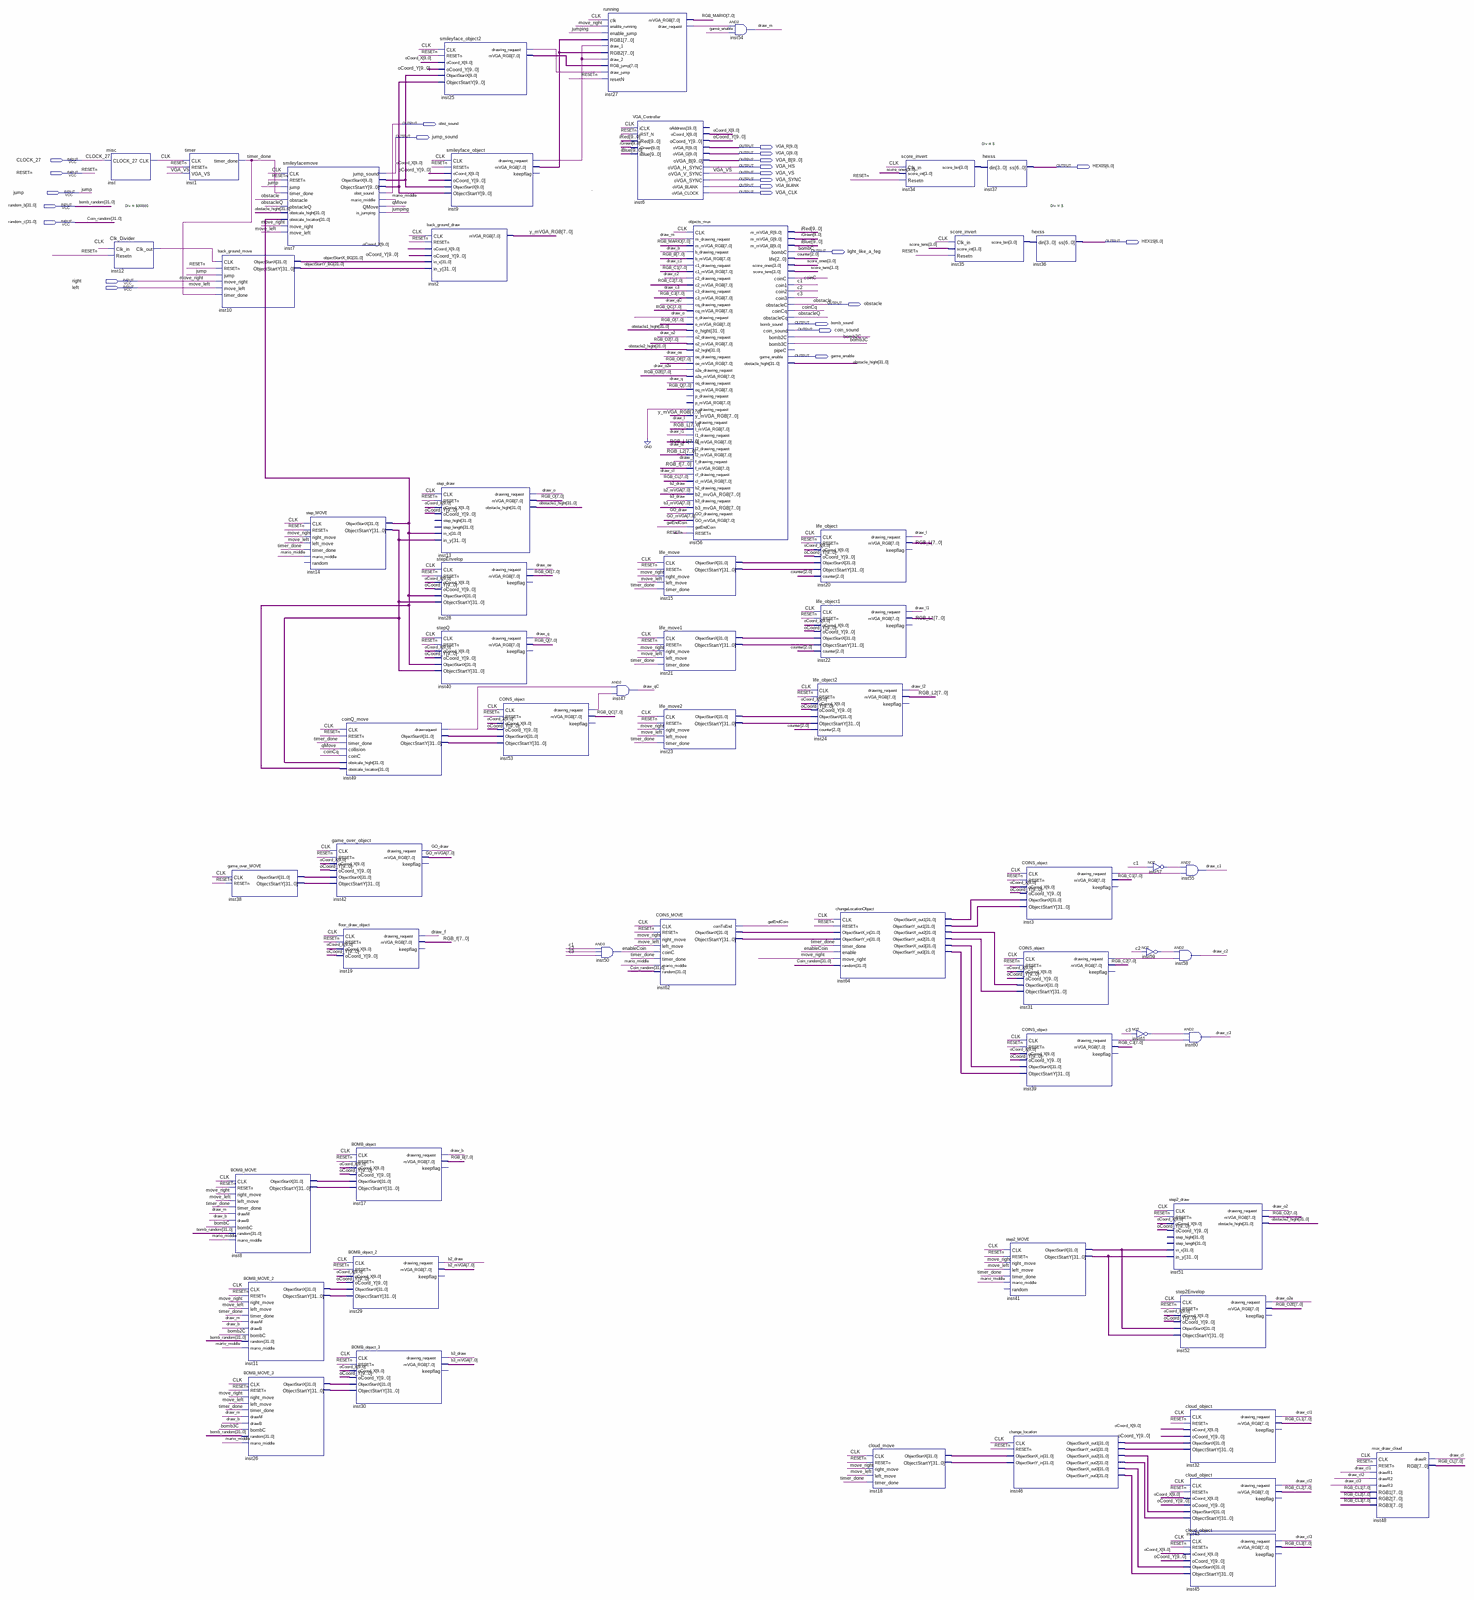
[diagram p0: schematic sheet, whole]
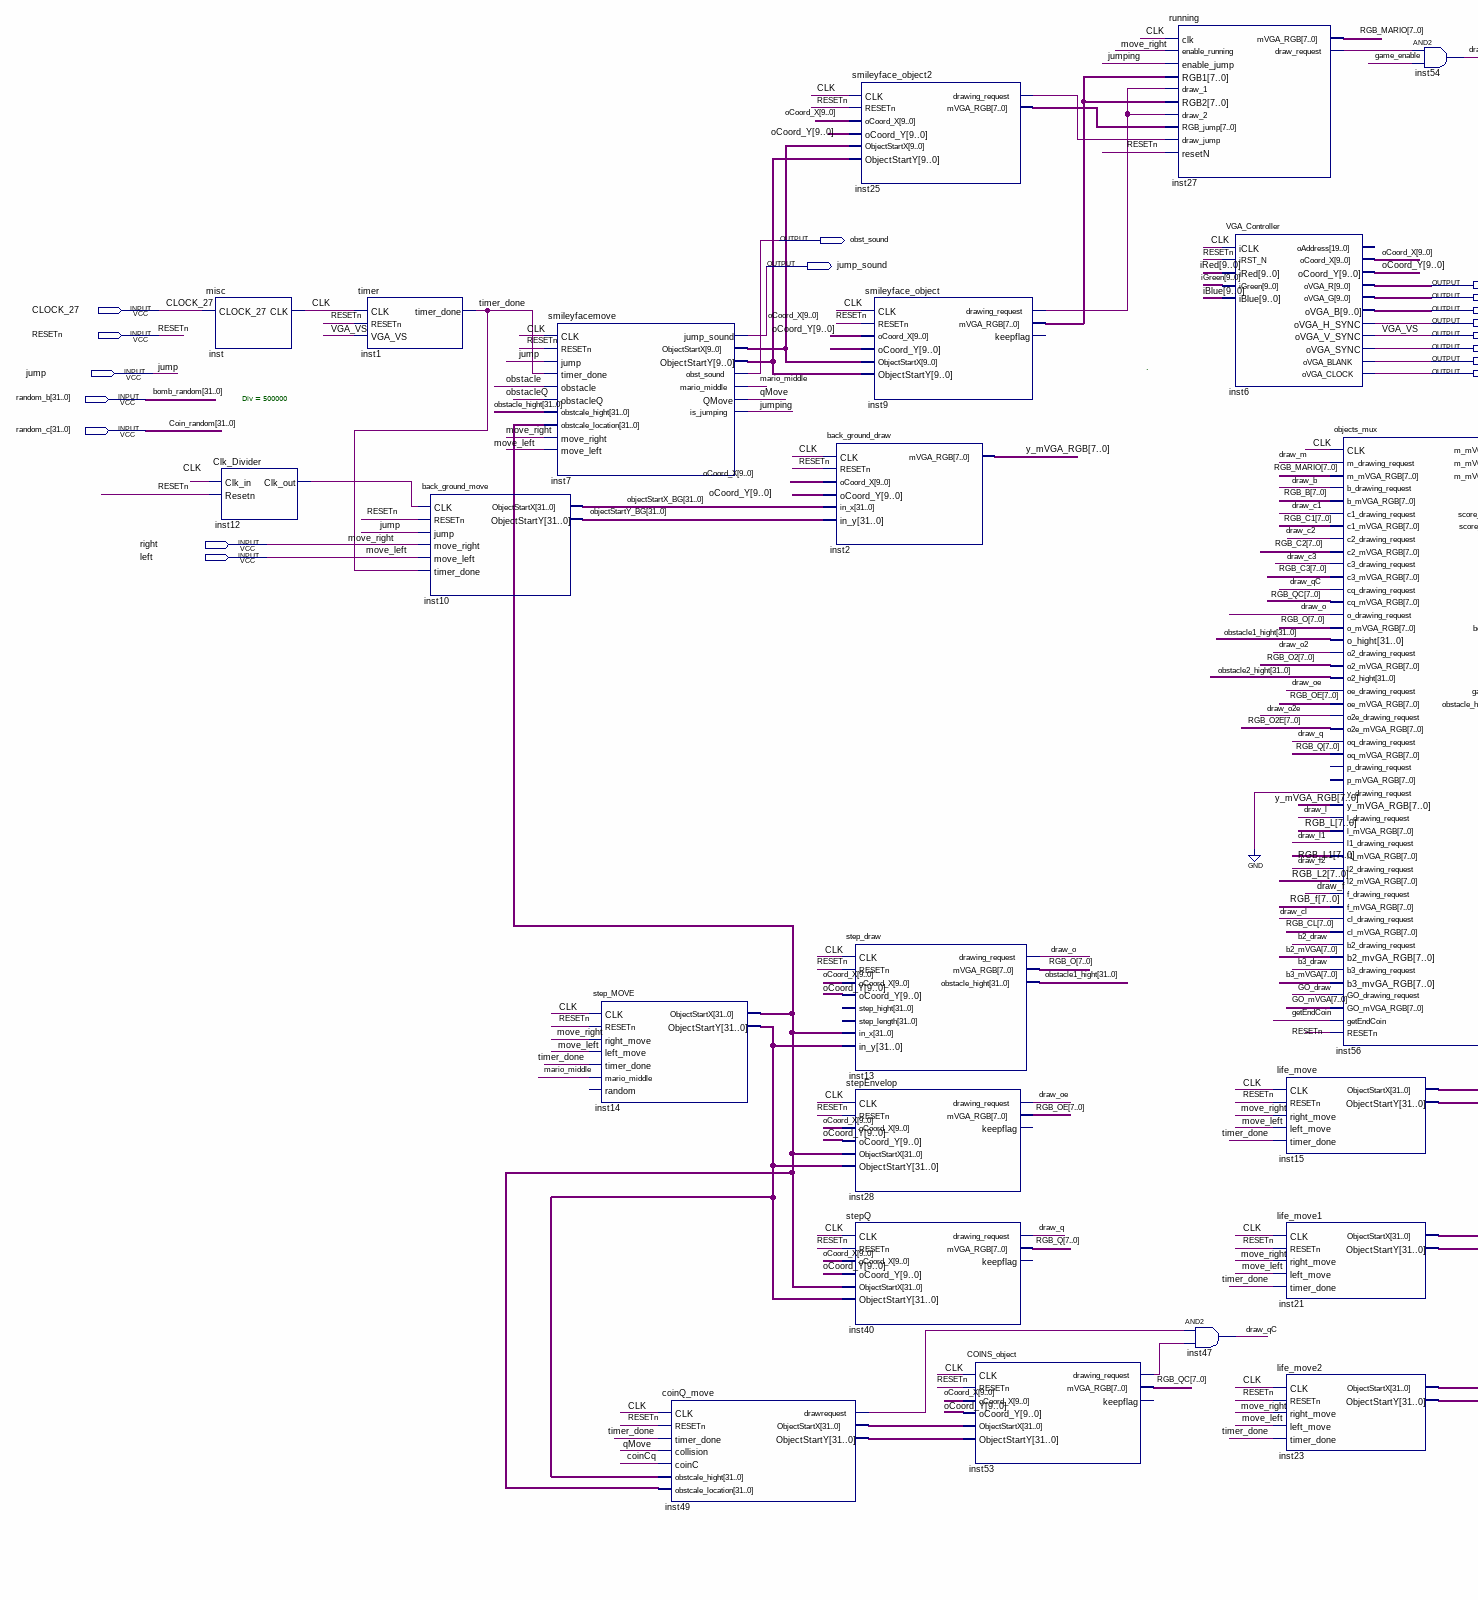
[diagram p1: schematic sheet, upper left part]
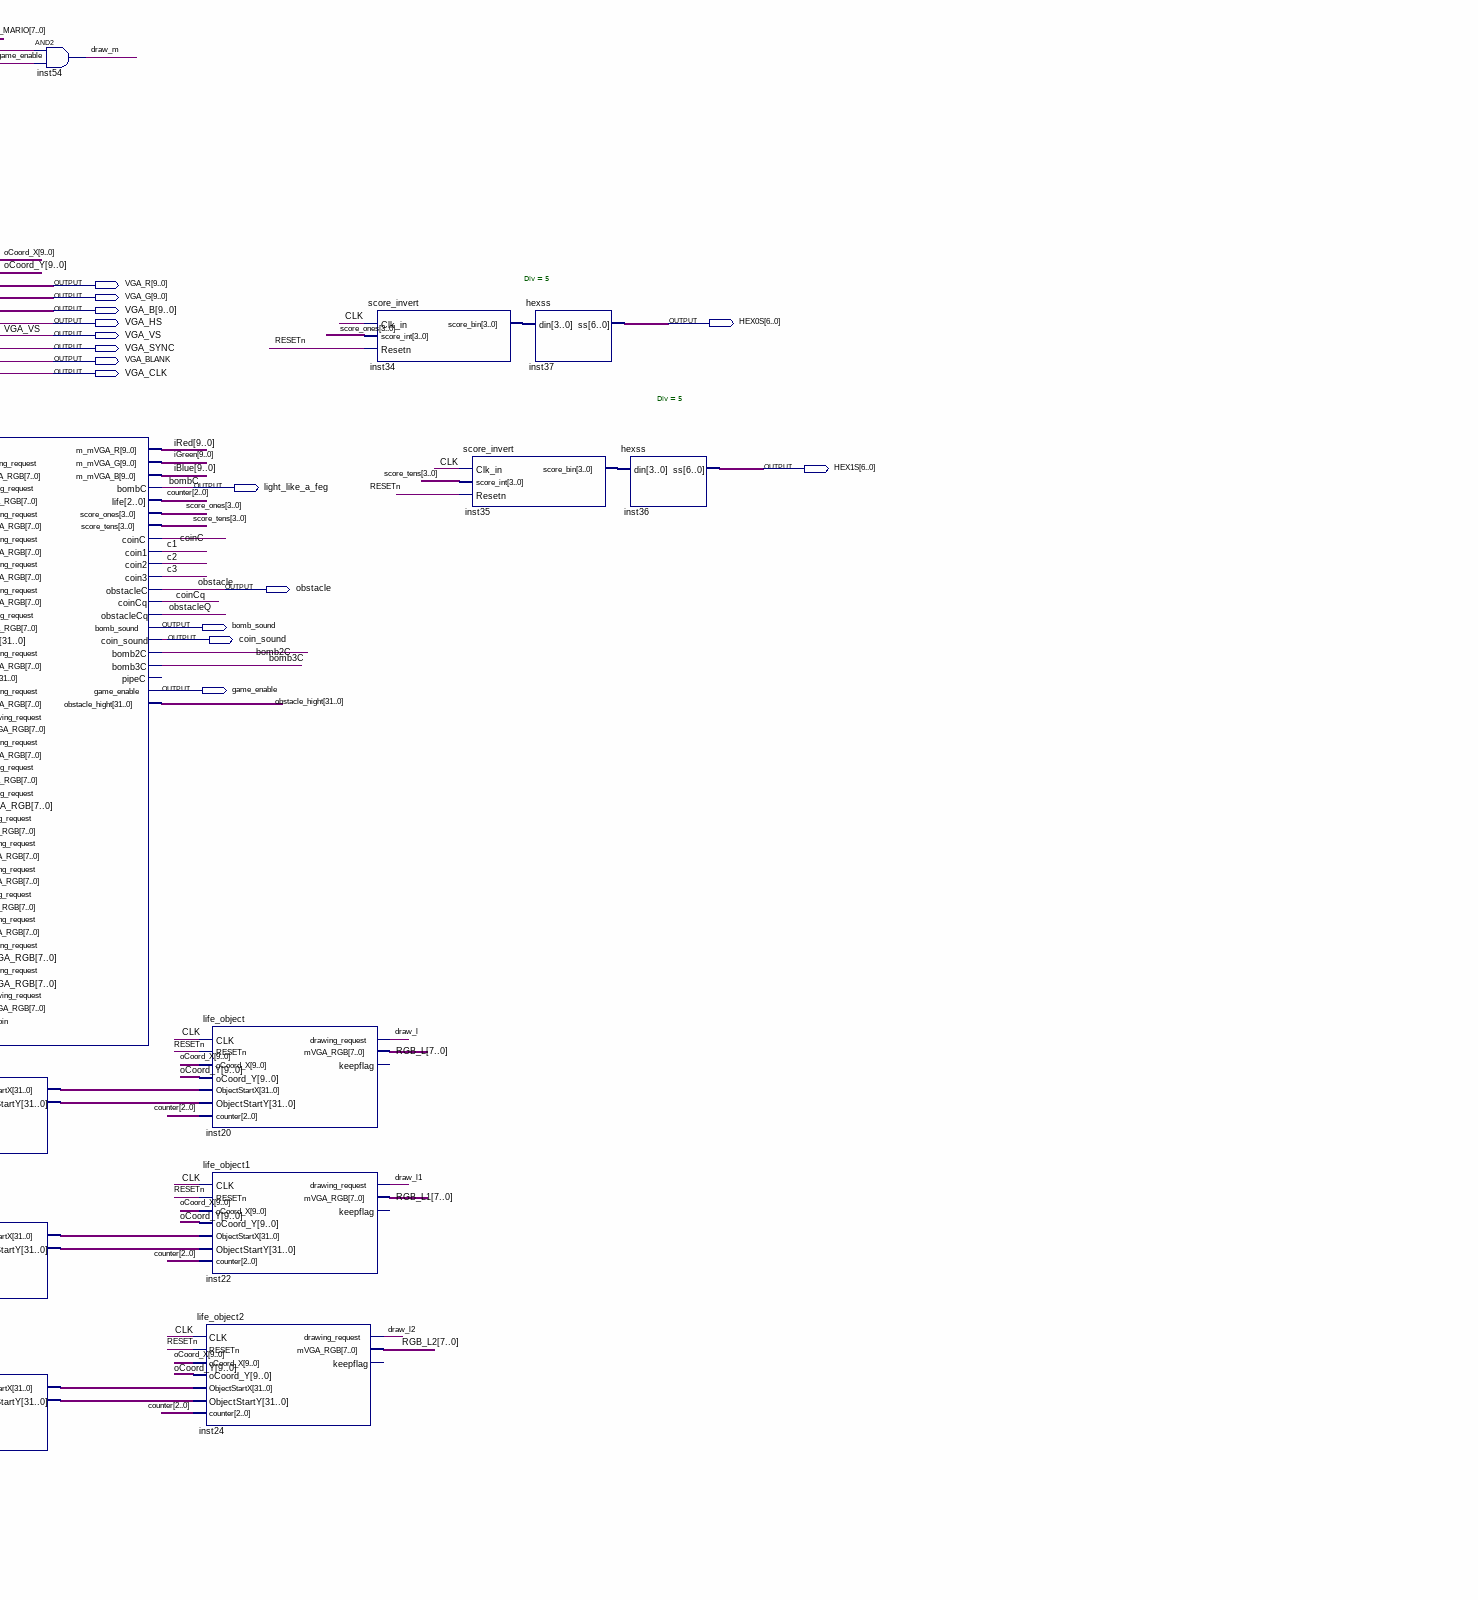
[diagram p2: schematic sheet, upper right part]
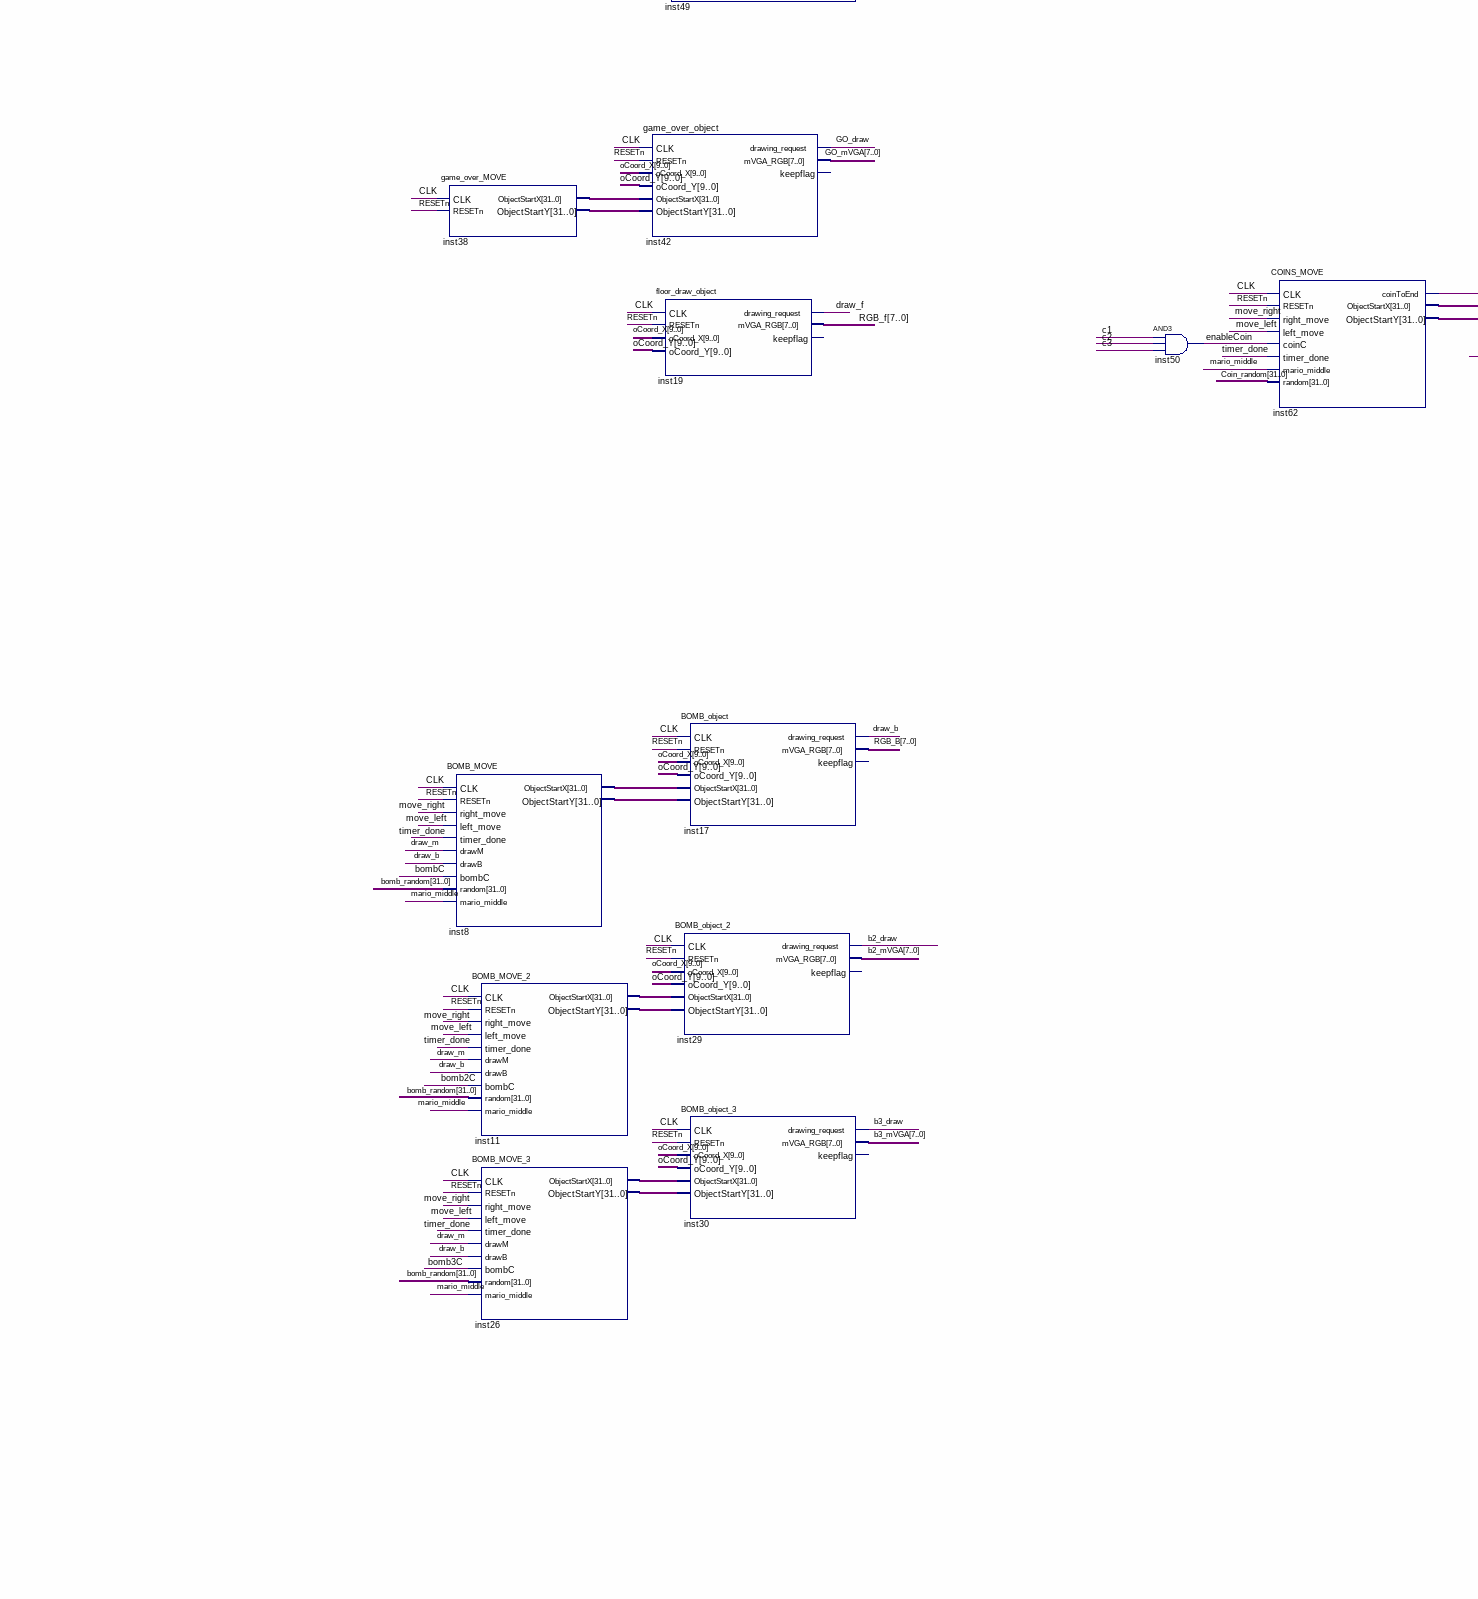
[diagram p3: schematic sheet, lower left part]
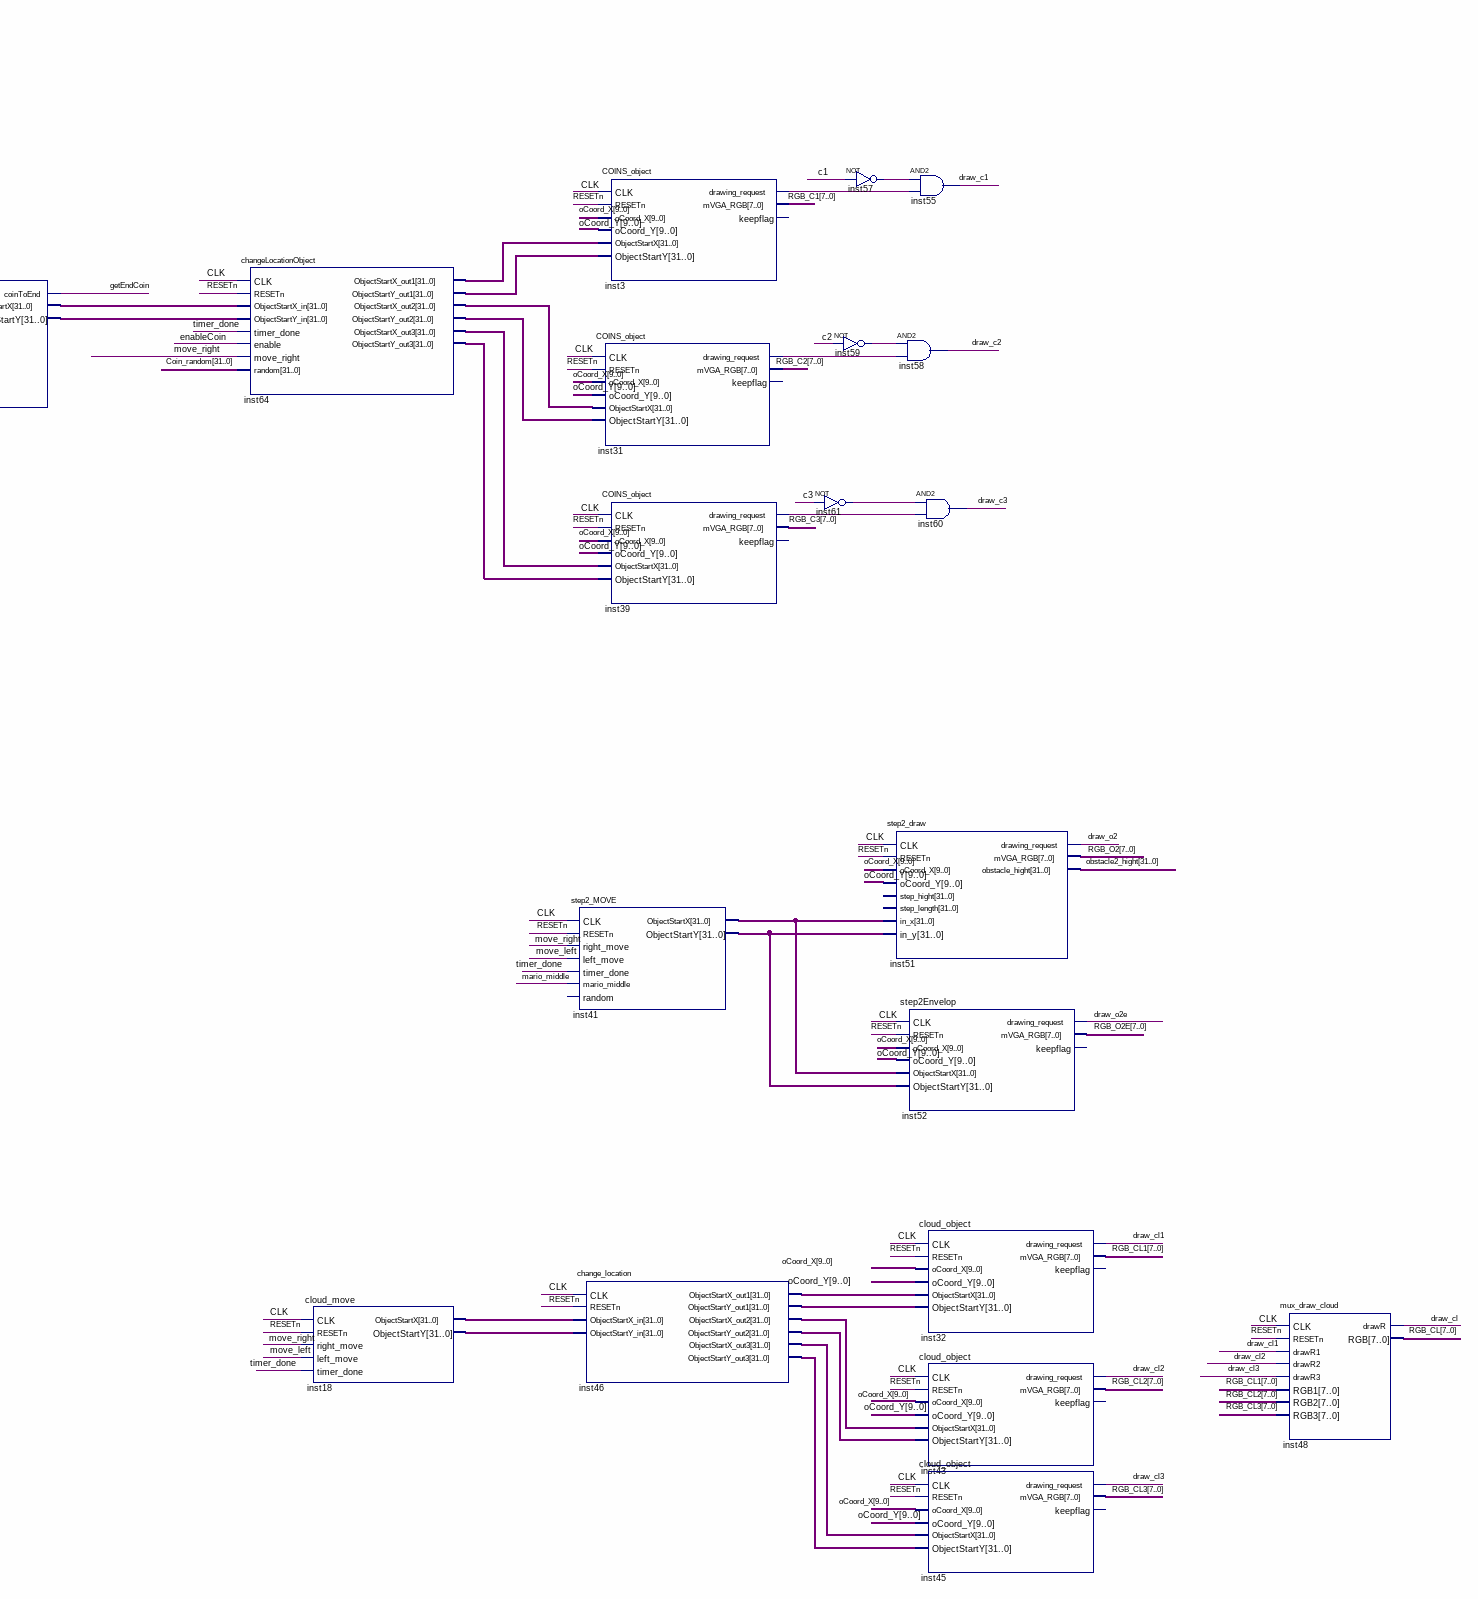
[diagram p4: schematic sheet, lower right part]
// Quartus schematic TOP_SIFTACH.bdf as structural Verilog: 59 symbols, 24 pins
module TOP_SIFTACH (
  input  CLOCK_27,
  input  RESETn,
  input  jump,
  input  [31:0] random_b,
  input  [31:0] random_c,
  input  right,
  input  left,
  output obst_sound,
  output jump_sound,
  output [9:0] VGA_R,
  output [9:0] VGA_G,
  output [9:0] VGA_B,
  output VGA_HS,
  output [6:0] HEX0S,
  output VGA_VS,
  output VGA_SYNC,
  output VGA_BLANK,
  output VGA_CLK,
  output [6:0] HEX1S,
  output light_like_a_feg,
  output obstacle,
  output bomb_sound,
  output coin_sound,
  output game_enable
);

  wire b2_draw, b3_draw, bomb2C, bomb3C, c1, c2, c3, CLK, coinC, coinCq, draw_b, draw_c1, draw_c2, draw_c3,
       draw_cl, draw_cl1, draw_cl2, draw_cl3, draw_f, draw_l, draw_l1, draw_l2, draw_m, draw_o, draw_o2,
       draw_o2e, draw_oe, draw_q, draw_qC, enableCoin, getEndCoin, GO_draw, inst3_drawing_request,
       inst9_drawing_request, inst12_clk_out, inst25_drawing_request, inst27_draw_request,
       inst31_drawing_request, inst39_drawing_request, inst49_drawrequest, inst53_drawing_request,
       inst57_out, inst59_out, inst61_out, jumping, mario_middle, obstacleQ, qMove, timer_done;
  wire [2:0] counter;
  wire [3:0] inst34_score_bin, inst35_score_bin, score_ones, score_tens;
  wire [7:0] b2_mVGA, b3_mVGA, GO_mVGA, inst9_mvga_rgb, inst25_mvga_rgb, RGB_B, RGB_C1, RGB_C2, RGB_C3,
       RGB_CL, RGB_CL1, RGB_CL2, RGB_CL3, RGB_f, RGB_L, RGB_L1, RGB_L2, RGB_MARIO, RGB_O, RGB_O2, RGB_O2E,
       RGB_OE, RGB_Q, RGB_QC, y_mVGA_RGB;
  wire [9:0] iBlue, iGreen, inst7_objectstartx, inst7_objectstarty, iRed, oCoord_X, oCoord_Y;
  wire [31:0] inst8_objectstartx, inst8_objectstarty, inst11_objectstartx, inst11_objectstarty,
       inst14_objectstartx, inst14_objectstarty, inst15_objectstartx, inst15_objectstarty,
       inst18_objectstartx, inst18_objectstarty, inst21_objectstartx, inst21_objectstarty,
       inst23_objectstartx, inst23_objectstarty, inst26_objectstartx, inst26_objectstarty,
       inst38_objectstartx, inst38_objectstarty, inst41_objectstartx, inst41_objectstarty,
       inst46_objectstartx_out1, inst46_objectstartx_out2, inst46_objectstartx_out3,
       inst46_objectstarty_out1, inst46_objectstarty_out2, inst46_objectstarty_out3, inst49_objectstartx,
       inst49_objectstarty, inst62_objectstartx, inst62_objectstarty, inst64_objectstartx_out1,
       inst64_objectstartx_out2, inst64_objectstartx_out3, inst64_objectstarty_out1,
       inst64_objectstarty_out2, inst64_objectstarty_out3, objectStartX_BG, objectStartY_BG, obstacle1_hight,
       obstacle2_hight, obstacle_hight;

  misc inst (.CLOCK_27(CLOCK_27), .CLK(CLK));
  Clk_Divider #(.Div(500000)) inst12 (.Clk_in(CLK), .Resetn(RESETn), .Clk_out(inst12_clk_out));
  timer inst1 (.CLK(CLK), .RESETn(RESETn), .VGA_VS(VGA_VS), .timer_done(timer_done));
  back_ground_move inst10 (
    .CLK(inst12_clk_out), .RESETn(RESETn), .jump(jump), .move_right(right), .move_left(left),
    .timer_done(timer_done), .ObjectStartX(objectStartX_BG), .ObjectStartY(objectStartY_BG));
  game_over_MOVE inst38 (
    .CLK(CLK), .RESETn(RESETn), .ObjectStartX(inst38_objectstartx), .ObjectStartY(inst38_objectstarty));
  BOMB_MOVE inst8 (
    .CLK(CLK), .RESETn(RESETn), .right_move(right), .left_move(left), .timer_done(timer_done),
    .drawM(draw_m), .drawB(draw_b), .bombC(light_like_a_feg), .random(random_b), .mario_middle(mario_middle),
    .ObjectStartX(inst8_objectstartx), .ObjectStartY(inst8_objectstarty));
  BOMB_MOVE_2 inst11 (
    .CLK(CLK), .RESETn(RESETn), .right_move(right), .left_move(left), .timer_done(timer_done),
    .drawM(draw_m), .drawB(draw_b), .bombC(bomb2C), .random(random_b), .mario_middle(mario_middle),
    .ObjectStartX(inst11_objectstartx), .ObjectStartY(inst11_objectstarty));
  BOMB_MOVE_3 inst26 (
    .CLK(CLK), .RESETn(RESETn), .right_move(right), .left_move(left), .timer_done(timer_done),
    .drawM(draw_m), .drawB(draw_b), .bombC(bomb3C), .random(random_b), .mario_middle(mario_middle),
    .ObjectStartX(inst26_objectstartx), .ObjectStartY(inst26_objectstarty));
  smileyfacemove inst7 (
    .CLK(CLK), .RESETn(RESETn), .jump(jump), .timer_done(timer_done), .obstacle(obstacle),
    .obstacleQ(obstacleQ), .obstcale_hight(obstacle_hight), .obstcale_location(inst14_objectstartx),
    .move_right(right), .move_left(left), .jump_sound(jump_sound), .ObjectStartX(inst7_objectstartx),
    .ObjectStartY(inst7_objectstarty), .obst_sound(obst_sound), .mario_middle(mario_middle), .QMove(qMove),
    .is_jumping(jumping));
  step_MOVE inst14 (
    .CLK(CLK), .RESETn(RESETn), .right_move(right), .left_move(left), .timer_done(timer_done),
    .mario_middle(mario_middle), .ObjectStartX(inst14_objectstartx), .ObjectStartY(inst14_objectstarty));  // open: random
  coinQ_move inst49 (
    .CLK(CLK), .RESETn(RESETn), .timer_done(timer_done), .collision(qMove), .coinC(coinCq),
    .obstcale_hight(inst14_objectstarty), .obstcale_location(inst14_objectstartx),
    .drawrequest(inst49_drawrequest), .ObjectStartX(inst49_objectstartx), .ObjectStartY(inst49_objectstarty));
  game_over_object inst42 (
    .CLK(CLK), .RESETn(RESETn), .oCoord_X(oCoord_X), .oCoord_Y(oCoord_Y), .ObjectStartX(inst38_objectstartx),
    .ObjectStartY(inst38_objectstarty), .drawing_request(GO_draw), .mVGA_RGB(GO_mVGA));  // open: keepflag
  floor_draw_object inst19 (
    .CLK(CLK), .RESETn(RESETn), .oCoord_X(oCoord_X), .oCoord_Y(oCoord_Y), .drawing_request(draw_f),
    .mVGA_RGB(RGB_f));  // open: keepflag
  BOMB_object inst17 (
    .CLK(CLK), .RESETn(RESETn), .oCoord_X(oCoord_X), .oCoord_Y(oCoord_Y), .ObjectStartX(inst8_objectstartx),
    .ObjectStartY(inst8_objectstarty), .drawing_request(draw_b), .mVGA_RGB(RGB_B));  // open: keepflag
  BOMB_object_2 inst29 (
    .CLK(CLK), .RESETn(RESETn), .oCoord_X(oCoord_X), .oCoord_Y(oCoord_Y), .ObjectStartX(inst11_objectstartx),
    .ObjectStartY(inst11_objectstarty), .drawing_request(b2_draw), .mVGA_RGB(b2_mVGA));  // open: keepflag
  BOMB_object_3 inst30 (
    .CLK(CLK), .RESETn(RESETn), .oCoord_X(oCoord_X), .oCoord_Y(oCoord_Y), .ObjectStartX(inst26_objectstartx),
    .ObjectStartY(inst26_objectstarty), .drawing_request(b3_draw), .mVGA_RGB(b3_mVGA));  // open: keepflag
  back_ground_draw inst2 (
    .CLK(CLK), .RESETn(RESETn), .oCoord_X(oCoord_X), .oCoord_Y(oCoord_Y), .in_x(objectStartX_BG),
    .in_y(objectStartY_BG), .mVGA_RGB(y_mVGA_RGB));
  smileyface_object2 inst25 (
    .CLK(CLK), .RESETn(RESETn), .oCoord_X(oCoord_X), .oCoord_Y(oCoord_Y), .ObjectStartX(inst7_objectstartx),
    .ObjectStartY(inst7_objectstarty), .drawing_request(inst25_drawing_request), .mVGA_RGB(inst25_mvga_rgb));
  smileyface_object inst9 (
    .CLK(CLK), .RESETn(RESETn), .oCoord_X(oCoord_X), .oCoord_Y(oCoord_Y), .ObjectStartX(inst7_objectstartx),
    .ObjectStartY(inst7_objectstarty), .drawing_request(inst9_drawing_request), .mVGA_RGB(inst9_mvga_rgb));  // open: keepflag
  step_draw inst13 (
    .CLK(CLK), .RESETn(RESETn), .oCoord_X(oCoord_X), .oCoord_Y(oCoord_Y), .in_x(inst14_objectstartx),
    .in_y(inst14_objectstarty), .drawing_request(draw_o), .mVGA_RGB(RGB_O), .obstacle_hight(obstacle1_hight));  // open: step_hight, step_length
  stepEnvelop inst28 (
    .CLK(CLK), .RESETn(RESETn), .oCoord_X(oCoord_X), .oCoord_Y(oCoord_Y), .ObjectStartX(inst14_objectstartx),
    .ObjectStartY(inst14_objectstarty), .drawing_request(draw_oe), .mVGA_RGB(RGB_OE));  // open: keepflag
  stepQ inst40 (
    .CLK(CLK), .RESETn(RESETn), .oCoord_X(oCoord_X), .oCoord_Y(oCoord_Y), .ObjectStartX(inst14_objectstartx),
    .ObjectStartY(inst14_objectstarty), .drawing_request(draw_q), .mVGA_RGB(RGB_Q));  // open: keepflag
  COINS_object inst53 (
    .CLK(CLK), .RESETn(RESETn), .oCoord_X(oCoord_X), .oCoord_Y(oCoord_Y), .ObjectStartX(inst49_objectstartx),
    .ObjectStartY(inst49_objectstarty), .drawing_request(inst53_drawing_request), .mVGA_RGB(RGB_QC));  // open: keepflag
  running inst27 (
    .clk(CLK), .enable_running(right), .enable_jump(jumping), .RGB1(inst9_mvga_rgb),
    .draw_1(inst9_drawing_request), .RGB2(inst9_mvga_rgb), .draw_2(inst9_drawing_request),
    .RGB_jump(inst25_mvga_rgb), .draw_jump(inst25_drawing_request), .resetN(RESETn), .mVGA_RGB(RGB_MARIO),
    .draw_request(inst27_draw_request));
  and inst47 (draw_qC, inst49_drawrequest, inst53_drawing_request);
  and inst50 (enableCoin, c1, c2, c3);
  VGA_Controller inst6 (
    .iCLK(CLK), .iRST_N(RESETn), .iRed(iRed), .iGreen(iGreen), .iBlue(iBlue), .oCoord_X(oCoord_X),
    .oCoord_Y(oCoord_Y), .oVGA_R(VGA_R), .oVGA_G(VGA_G), .oVGA_B(VGA_B), .oVGA_H_SYNC(VGA_HS),
    .oVGA_V_SYNC(VGA_VS), .oVGA_SYNC(VGA_SYNC), .oVGA_BLANK(VGA_BLANK), .oVGA_CLOCK(VGA_CLK));  // open: oAddress
  life_move inst15 (
    .CLK(CLK), .RESETn(RESETn), .right_move(right), .left_move(left), .timer_done(timer_done),
    .ObjectStartX(inst15_objectstartx), .ObjectStartY(inst15_objectstarty));
  life_move1 inst21 (
    .CLK(CLK), .RESETn(RESETn), .right_move(right), .left_move(left), .timer_done(timer_done),
    .ObjectStartX(inst21_objectstartx), .ObjectStartY(inst21_objectstarty));
  life_move2 inst23 (
    .CLK(CLK), .RESETn(RESETn), .right_move(right), .left_move(left), .timer_done(timer_done),
    .ObjectStartX(inst23_objectstartx), .ObjectStartY(inst23_objectstarty));
  COINS_MOVE inst62 (
    .CLK(CLK), .RESETn(RESETn), .right_move(right), .left_move(left), .coinC(enableCoin),
    .timer_done(timer_done), .mario_middle(mario_middle), .random(random_c), .coinToEnd(getEndCoin),
    .ObjectStartX(inst62_objectstartx), .ObjectStartY(inst62_objectstarty));
  objects_mux inst56 (
    .CLK(CLK), .m_drawing_request(draw_m), .m_mVGA_RGB(RGB_MARIO), .b_drawing_request(draw_b),
    .b_mVGA_RGB(RGB_B), .c1_drawing_request(draw_c1), .c1_mVGA_RGB(RGB_C1), .c2_drawing_request(draw_c2),
    .c2_mVGA_RGB(RGB_C2), .c3_drawing_request(draw_c3), .c3_mVGA_RGB(RGB_C3), .cq_drawing_request(draw_qC),
    .cq_mVGA_RGB(RGB_QC), .o_drawing_request(draw_o), .o_mVGA_RGB(RGB_O), .o_hight(obstacle1_hight),
    .o2_drawing_request(draw_o2), .o2_mVGA_RGB(RGB_O2), .o2_hight(obstacle2_hight),
    .oe_drawing_request(draw_oe), .oe_mVGA_RGB(RGB_OE), .o2e_drawing_request(draw_o2e),
    .o2e_mVGA_RGB(RGB_O2E), .oq_drawing_request(draw_q), .oq_mVGA_RGB(RGB_Q), .y_drawing_request(1'b0),
    .y_mVGA_RGB(y_mVGA_RGB), .l_drawing_request(draw_l), .l_mVGA_RGB(RGB_L), .l1_drawing_request(draw_l1),
    .l1_mVGA_RGB(RGB_L1), .l2_drawing_request(draw_l2), .l2_mVGA_RGB(RGB_L2), .f_drawing_request(draw_f),
    .f_mVGA_RGB(RGB_f), .cl_drawing_request(draw_cl), .cl_mVGA_RGB(RGB_CL), .b2_drawing_request(b2_draw),
    .b2_mvGA_RGB(b2_mVGA), .b3_drawing_request(b3_draw), .b3_mvGA_RGB(b3_mVGA), .GO_drawing_request(GO_draw),
    .GO_mVGA_RGB(GO_mVGA), .getEndCoin(getEndCoin), .RESETn(RESETn), .m_mVGA_R(iRed), .m_mVGA_G(iGreen),
    .m_mVGA_B(iBlue), .bombC(light_like_a_feg), .life(counter), .score_ones(score_ones),
    .score_tens(score_tens), .coinC(coinC), .coin1(c1), .coin2(c2), .coin3(c3), .obstacleC(obstacle),
    .coinCq(coinCq), .obstacleCq(obstacleQ), .bomb_sound(bomb_sound), .coin_sound(coin_sound),
    .bomb2C(bomb2C), .bomb3C(bomb3C), .game_enable(game_enable), .obstacle_hight(obstacle_hight));  // open: p_drawing_request, p_mVGA_RGB, pipeC
  and inst54 (draw_m, inst27_draw_request, game_enable);
  life_object inst20 (
    .CLK(CLK), .RESETn(RESETn), .oCoord_X(oCoord_X), .oCoord_Y(oCoord_Y), .ObjectStartX(inst15_objectstartx),
    .ObjectStartY(inst15_objectstarty), .counter(counter), .drawing_request(draw_l), .mVGA_RGB(RGB_L));  // open: keepflag
  life_object1 inst22 (
    .CLK(CLK), .RESETn(RESETn), .oCoord_X(oCoord_X), .oCoord_Y(oCoord_Y), .ObjectStartX(inst21_objectstartx),
    .ObjectStartY(inst21_objectstarty), .counter(counter), .drawing_request(draw_l1), .mVGA_RGB(RGB_L1));  // open: keepflag
  life_object2 inst24 (
    .CLK(CLK), .RESETn(RESETn), .oCoord_X(oCoord_X), .oCoord_Y(oCoord_Y), .ObjectStartX(inst23_objectstartx),
    .ObjectStartY(inst23_objectstarty), .counter(counter), .drawing_request(draw_l2), .mVGA_RGB(RGB_L2));  // open: keepflag
  changeLocationObject inst64 (
    .CLK(CLK), .RESETn(RESETn), .ObjectStartX_in(inst62_objectstartx), .ObjectStartY_in(inst62_objectstarty),
    .timer_done(timer_done), .enable(enableCoin), .move_right(right), .random(random_c),
    .ObjectStartX_out1(inst64_objectstartx_out1), .ObjectStartY_out1(inst64_objectstarty_out1),
    .ObjectStartX_out2(inst64_objectstartx_out2), .ObjectStartY_out2(inst64_objectstarty_out2),
    .ObjectStartX_out3(inst64_objectstartx_out3), .ObjectStartY_out3(inst64_objectstarty_out3));
  cloud_move inst18 (
    .CLK(CLK), .RESETn(RESETn), .right_move(right), .left_move(left), .timer_done(timer_done),
    .ObjectStartX(inst18_objectstartx), .ObjectStartY(inst18_objectstarty));
  score_invert #(.Div(5)) inst34 (.Clk_in(CLK), .score_int(score_ones), .Resetn(RESETn), .score_bin(inst34_score_bin));
  score_invert #(.Div(5)) inst35 (.Clk_in(CLK), .score_int(score_tens), .Resetn(RESETn), .score_bin(inst35_score_bin));
  hexss inst37 (.din(inst34_score_bin), .ss(HEX0S));
  step2_MOVE inst41 (
    .CLK(CLK), .RESETn(RESETn), .right_move(right), .left_move(left), .timer_done(timer_done),
    .mario_middle(mario_middle), .ObjectStartX(inst41_objectstartx), .ObjectStartY(inst41_objectstarty));  // open: random
  change_location inst46 (
    .CLK(CLK), .RESETn(RESETn), .ObjectStartX_in(inst18_objectstartx), .ObjectStartY_in(inst18_objectstarty),
    .ObjectStartX_out1(inst46_objectstartx_out1), .ObjectStartY_out1(inst46_objectstarty_out1),
    .ObjectStartX_out2(inst46_objectstartx_out2), .ObjectStartY_out2(inst46_objectstarty_out2),
    .ObjectStartX_out3(inst46_objectstartx_out3), .ObjectStartY_out3(inst46_objectstarty_out3));
  hexss inst36 (.din(inst35_score_bin), .ss(HEX1S));
  COINS_object inst3 (
    .CLK(CLK), .RESETn(RESETn), .oCoord_X(oCoord_X), .oCoord_Y(oCoord_Y),
    .ObjectStartX(inst64_objectstartx_out1), .ObjectStartY(inst64_objectstarty_out1),
    .drawing_request(inst3_drawing_request), .mVGA_RGB(RGB_C1));  // open: keepflag
  COINS_object inst31 (
    .CLK(CLK), .RESETn(RESETn), .oCoord_X(oCoord_X), .oCoord_Y(oCoord_Y),
    .ObjectStartX(inst64_objectstartx_out2), .ObjectStartY(inst64_objectstarty_out2),
    .drawing_request(inst31_drawing_request), .mVGA_RGB(RGB_C2));  // open: keepflag
  COINS_object inst39 (
    .CLK(CLK), .RESETn(RESETn), .oCoord_X(oCoord_X), .oCoord_Y(oCoord_Y),
    .ObjectStartX(inst64_objectstartx_out3), .ObjectStartY(inst64_objectstarty_out3),
    .drawing_request(inst39_drawing_request), .mVGA_RGB(RGB_C3));  // open: keepflag
  not inst61 (inst61_out, c3);
  not inst57 (inst57_out, c1);
  not inst59 (inst59_out, c2);
  and inst55 (draw_c1, inst57_out, inst3_drawing_request);
  and inst58 (draw_c2, inst59_out, inst31_drawing_request);
  and inst60 (draw_c3, inst61_out, inst39_drawing_request);
  step2_draw inst51 (
    .CLK(CLK), .RESETn(RESETn), .oCoord_X(oCoord_X), .oCoord_Y(oCoord_Y), .in_x(inst41_objectstartx),
    .in_y(inst41_objectstarty), .drawing_request(draw_o2), .mVGA_RGB(RGB_O2), .obstacle_hight(obstacle2_hight));  // open: step_hight, step_length
  step2Envelop inst52 (
    .CLK(CLK), .RESETn(RESETn), .oCoord_X(oCoord_X), .oCoord_Y(oCoord_Y), .ObjectStartX(inst41_objectstartx),
    .ObjectStartY(inst41_objectstarty), .drawing_request(draw_o2e), .mVGA_RGB(RGB_O2E));  // open: keepflag
  cloud_object inst32 (
    .CLK(CLK), .RESETn(RESETn), .oCoord_X(oCoord_X), .oCoord_Y(oCoord_Y),
    .ObjectStartX(inst46_objectstartx_out1), .ObjectStartY(inst46_objectstarty_out1),
    .drawing_request(draw_cl1), .mVGA_RGB(RGB_CL1));  // open: keepflag
  cloud_object inst43 (
    .CLK(CLK), .RESETn(RESETn), .oCoord_X(oCoord_X), .oCoord_Y(oCoord_Y),
    .ObjectStartX(inst46_objectstartx_out2), .ObjectStartY(inst46_objectstarty_out2),
    .drawing_request(draw_cl2), .mVGA_RGB(RGB_CL2));  // open: keepflag
  cloud_object inst45 (
    .CLK(CLK), .RESETn(RESETn), .oCoord_X(oCoord_X), .oCoord_Y(oCoord_Y),
    .ObjectStartX(inst46_objectstartx_out3), .ObjectStartY(inst46_objectstarty_out3),
    .drawing_request(draw_cl3), .mVGA_RGB(RGB_CL3));  // open: keepflag
  mux_draw_cloud inst48 (
    .CLK(CLK), .RESETn(RESETn), .drawR1(draw_cl1), .drawR2(draw_cl2), .drawR3(draw_cl3), .RGB1(RGB_CL1),
    .RGB2(RGB_CL2), .RGB3(RGB_CL3), .drawR(draw_cl), .RGB(RGB_CL));

  // Other names for the same wires on the sheet: bomb_random[31:0] = random_b; bombC = light_like_a_feg;
  //   Coin_random[31:0] = random_c; move_left = left; move_right = right

  // Notes on the sheet:
  //   .
endmodule
